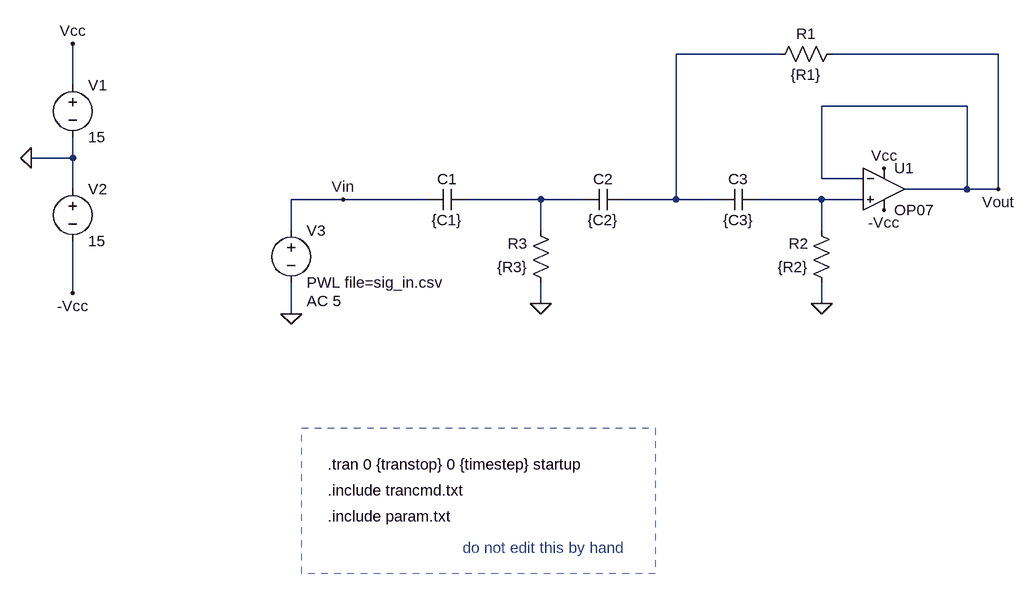
[diagram p0: schematic A6_AltaSK_3.asc]
A6_AltaSK_3.asc, the LTspice schematic file:
Version 4
SHEET 1 1020 680
WIRE 640 -240 480 -240
WIRE 976 -240 720 -240
WIRE -448 -192 -448 -256
WIRE 928 -160 704 -160
WIRE -448 -80 -448 -112
WIRE -448 -80 -512 -80
WIRE 704 -48 704 -160
WIRE 768 -48 704 -48
WIRE -448 -32 -448 -80
WIRE 928 -32 928 -160
WIRE 928 -32 832 -32
WIRE 976 -32 976 -240
WIRE 976 -32 928 -32
WIRE -32 -16 -112 -16
WIRE 96 -16 -32 -16
WIRE 272 -16 160 -16
WIRE 336 -16 272 -16
WIRE 480 -16 480 -240
WIRE 480 -16 400 -16
WIRE 544 -16 480 -16
WIRE 704 -16 608 -16
WIRE 768 -16 704 -16
WIRE -112 32 -112 -16
WIRE 272 32 272 -16
WIRE 704 32 704 -16
WIRE -448 128 -448 48
WIRE 272 144 272 112
WIRE 704 144 704 112
WIRE -112 160 -112 112
FLAG 976 -32 Vout
FLAG 704 144 0
FLAG -32 -16 Vin
FLAG -512 -80 0
FLAG -448 -256 Vcc
FLAG -448 128 -Vcc
FLAG 800 -64 Vcc
FLAG 800 0 -Vcc
FLAG -112 160 0
FLAG 272 144 0
SYMBOL res 736 -256 R90
WINDOW 0 0 56 VBottom 2
WINDOW 3 32 56 VTop 2
SYMATTR InstName R1
SYMATTR Value {R1}
SYMBOL cap 96 0 R270
WINDOW 0 32 32 VTop 2
WINDOW 3 0 32 VBottom 2
SYMATTR InstName C1
SYMATTR Value {C1}
SYMBOL OpAmps\\OP07 800 -96 R0
SYMATTR InstName U1
SYMBOL cap 400 -32 R90
WINDOW 0 0 32 VBottom 2
WINDOW 3 32 32 VTop 2
SYMATTR InstName C2
SYMATTR Value {C2}
SYMBOL voltage -448 -208 R0
WINDOW 123 0 0 Left 0
WINDOW 39 0 0 Left 0
SYMATTR InstName V1
SYMATTR Value 15
SYMBOL voltage -448 -48 R0
WINDOW 123 0 0 Left 0
WINDOW 39 0 0 Left 0
SYMATTR InstName V2
SYMATTR Value 15
SYMBOL voltage -112 16 R0
WINDOW 123 24 124 Left 2
WINDOW 39 0 0 Left 0
SYMATTR Value2 AC 5
SYMATTR InstName V3
SYMATTR Value PWL file=sig_in.csv
SYMBOL res 720 128 R180
WINDOW 0 36 76 Left 2
WINDOW 3 36 40 Left 2
SYMATTR InstName R2
SYMATTR Value {R2}
SYMBOL res 288 128 R180
WINDOW 0 36 76 Left 2
WINDOW 3 36 40 Left 2
SYMATTR InstName R3
SYMATTR Value {R3}
SYMBOL cap 608 -32 R90
WINDOW 0 0 32 VBottom 2
WINDOW 3 32 32 VTop 2
SYMATTR InstName C3
SYMATTR Value {C3}
TEXT -56 392 Left 2 !.tran 0 {transtop} 0 {timestep} startup
TEXT -56 472 Left 2 !.include param.txt
TEXT -56 432 Left 2 !.include trancmd.txt
TEXT 152 520 Left 2 ;do not edit this by hand
RECTANGLE Normal 448 560 -96 336 2

The netlist it stands for:
* A6_AltaSK_3.asc
R1 Vout N001 {R1}
C1 Vin N002 {C1}
XU1 N003 Vout Vcc -Vcc Vout LT1001  ; OP07, pins In+ In- V+ V- OUT
C2 N001 N002 {C2}
V1 Vcc 0 15
V2 0 -Vcc 15
V3 Vin 0 PWL file=sig_in.csv AC 5
R2 0 N003 {R2}
R3 0 N002 {R3}
C3 N003 N001 {C3}
.tran 0 {transtop} 0 {timestep} startup
.include param.txt
.include trancmd.txt
* do not edit this by hand
.lib LTC.lib
.backanno
.end

* Results of the author's LTspice run, read from the files saved beside the schematic
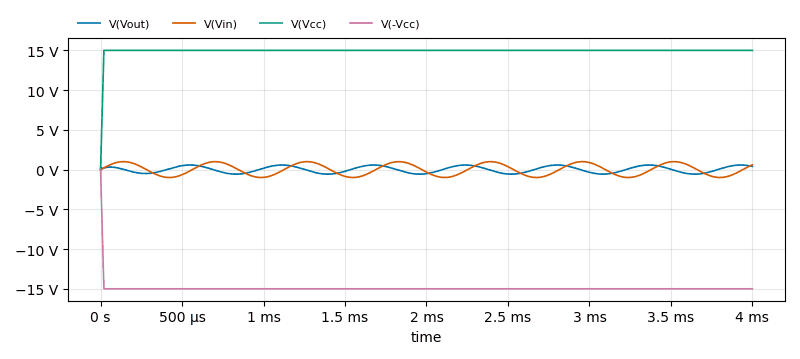
[diagram p1: Transient Analysis of A6_AltaSK_3.asc, plotted from the saved traces]
* Transient Analysis, 1 run:
*   V(Vout): min -576.8 mV, max 575.9 mV, average 9.425 mV, rms 400.5 mV, last 401.3 mV
*   V(Vin): min -1 V, max 1 V, average 4.554 mV, rms 703.2 mV, last 604.9 mV
*   V(Vcc): min 0 V, max 15 V, average 14.96 V, rms 14.98 V, last 15 V
*   V(-Vcc): min -15 V, max 0 V, average -14.96 V, rms 14.98 V, last -15 V